# Altium schematic sheet Schematic.SchDoc
size A4
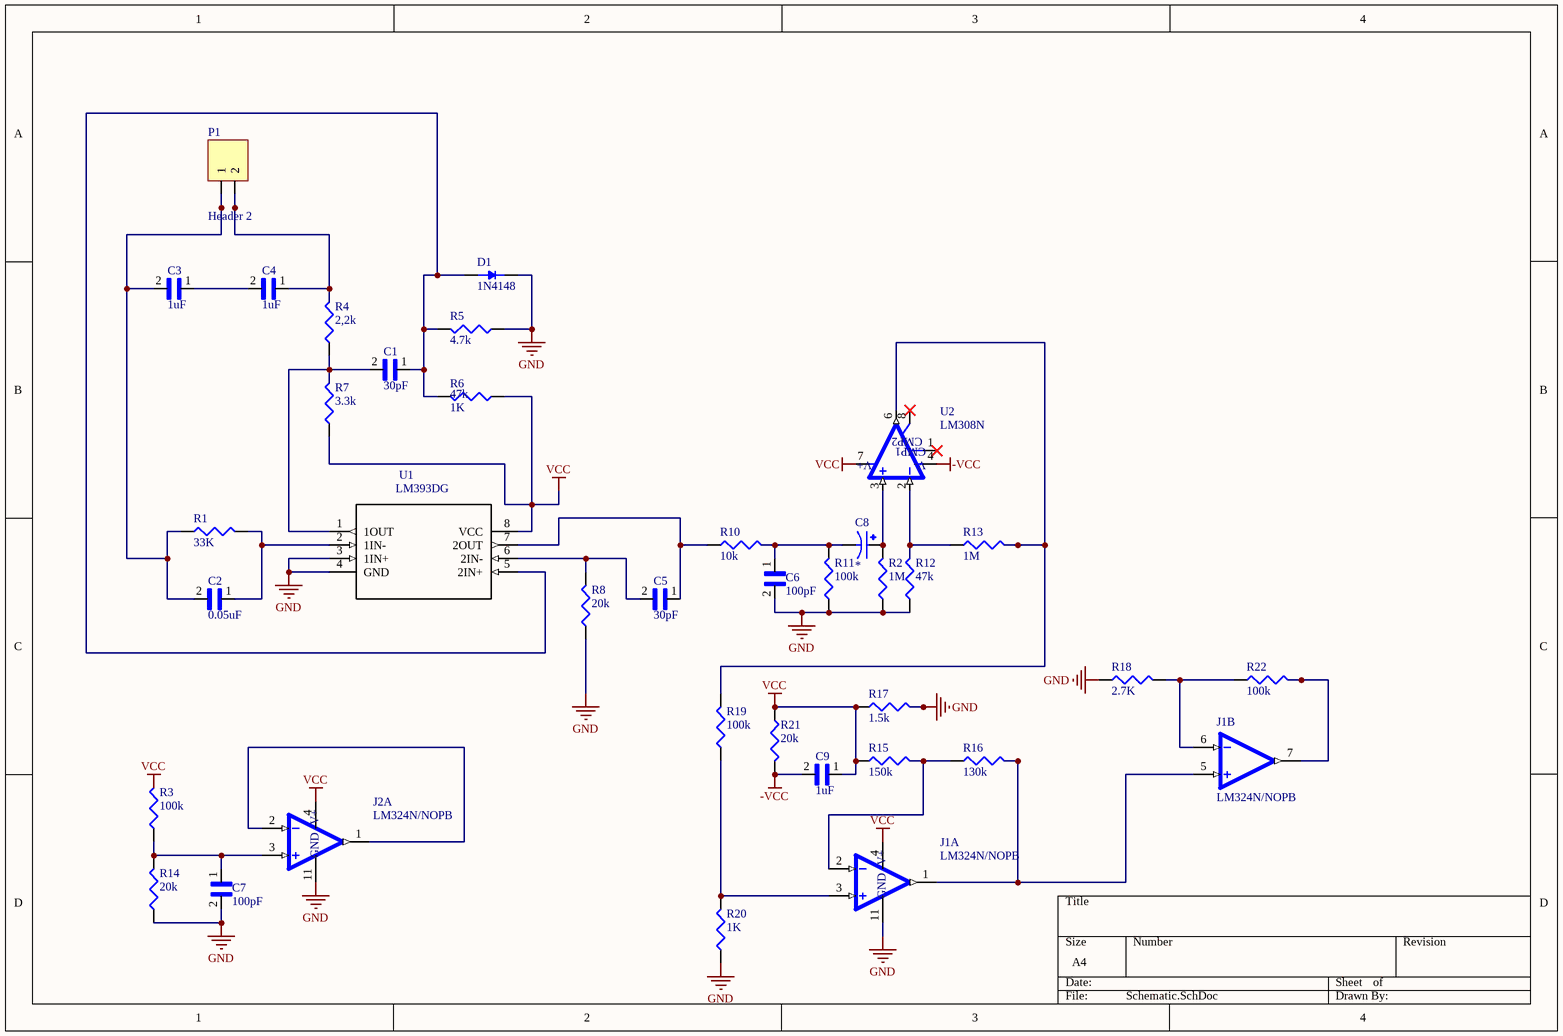
[diagram p0: Schematic.SchDoc]

## Parts
C1  30pF  [CAPC3216X190]
C2  0.05uF  [CAPC3216X190]
C3  1uF  [CAPC3216X190]
C4  1uF  [CAPC3216X190]
C5  30pF  [CAPC3216X190]
C6  100pF  [CAPC3216X190]
C7  100pF  [CAPC3216X190]
C8  *  [CAPPRD250W50D630H1120]
C9  1uF  [CAPC3216X190]
D1  1N4148  [DIODFN60X30X36-2N]
J1  LM324N/NOPB  [DIP825W47P254L1917H533Q14]  (parts A,B of 4)
J2  LM324N/NOPB  [DIP825W47P254L1917H533Q14]  (part A of 4)
P1  Header 2  [HDR1X2]
R1  value 33K  [J1-0603]
R2  value 1M  [J1-0603]
R3  value 100k  [J1-0603]
R4  value 2,2k  [J1-0603]
R5  value 4.7k  [J1-0603]
R6  47k  value 1K  [J1-0603]
R7  value 3.3k  [J1-0603]
R8  value 20k  [J1-0603]
R10  value 10k  [J1-0603]
R11  value 100k  [J1-0603]
R12  value 47k  [J1-0603]
R13  value 1M  [J1-0603]
R14  value 20k  [J1-0603]
R15  value 150k  [J1-0603]
R16  value 130k  [J1-0603]
R17  value 1.5k  [J1-0603]
R18  value 2.7K  [J1-0603]
R19  value 100k  [J1-0603]
R20  value 1K  [J1-0603]
R21  value 20k  [J1-0603]
R22  value 100k  [J1-0603]
U1  LM393DG  [SOIC127P599X175-8N]
U2  LM308N  [DIP794W45P254L1016H533Q8]

## Nets
-VCC: C9.2 R21.2 U2.4(V-)
GND: C6.2 C7.2 D1.C J1.11(GND) J2.11(GND) R2.1 R5.1 R8.1 R11.1 R12.1 R14.1 R17.2 R18.1 R20.1 U1.3(1IN+) U1.4(GND)
VCC: C9.1 J1.4(V+) J2.4(V+) R6.1 R7.1 R15.1 R17.1 R21.1 U1.8(VCC) U2.7(V+)
NetC1_1: C1.1 D1.A R5.2 R6.2 U1.5(2IN+)
NetC1_2: C1.2 R4.1 R7.2 U1.1(1OUT)
NetC2_1: C2.1 R1.2 U1.2(1IN-)
NetC2_2: C2.2 C3.2 P1.1 R1.1
NetC3_1: C3.1 C4.2
NetC4_1: C4.1 P1.2 R4.2
NetC5_1: C5.1 R10.1 U1.7(2OUT)
NetC5_2: C5.2 R8.2 U1.6(2IN-)
NetC6_1: C6.1 C8.N R10.2 R11.2
NetC7_1: C7.1 J2.3(1IN+) R3.1 R14.2
NetC8_P: C8.P R2.2 U2.3(+IN)
NetJ1_1: J1.1(1OUT) J1.5(2IN+) R16.2
NetJ1_2: J1.2(1IN-) R15.2 R16.1
NetJ1_3: J1.3(1IN+) R19.1 R20.2
NetJ1_6: J1.6(2IN-) R18.2 R22.1
NetJ1_7: J1.7(2OUT) R22.2
NetJ2_1: J2.1(1OUT) J2.2(1IN-)
NetR12_2: R12.2 R13.1 U2.2(-IN)
NetR13_2: R13.2 R19.2 U2.6(OUT)

Not connected (* = marked no-connect by the designer): R3 2; U2 1(CMP1)* 8(CMP2)*

## Notes on the sheet
- Labels drawn without touching a wire or pin: VCC

## Library data of the parts
C1-C7 C9 = GRM31CC80E157ME11K: ÐšÐµÑ€Ð°Ð¼Ð¸Ñ‡ÐµÑÐºÐ¸Ð¹ ÐºÐ¾Ð½Ð´ÐµÐ½ÑÐ°Ñ‚Ð¾Ñ€; MF: Murata; Value: *; Price: None; Availability: In Stock; Package: 1206 Murata; MP: GRM31CC80E157ME11K; SnapEDA_Link: https://www.snapeda.com/parts/GRM31CC80E157ME11K/Murata/view-part/?ref=snap; Purchase-URL: https://pricing.snapeda.com/search/part/GRM31CC80E157ME11K/?ref=eda; Check_prices: https://www.snapeda.com/parts/GRM31CC80E157ME11K/Murata/view-part/?ref=eda
C8 = ECA1JM330I: CAP ALUM 33UF 20% 63V RADIAL; MF: Panasonic; Value: *; SnapEDA_Link: https://www.snapeda.com/parts/ECA1JM330I/Panasonic/view-part/?ref=snap; Check_prices: https://www.snapeda.com/parts/ECA1JM330I/Panasonic/view-part/?ref=eda; Purchase-URL: https://pricing.snapeda.com/search/part/ECA1JM330I/?ref=eda; Availability: In Stock; MP: ECA1JM330I; Price: None; Package: RADIAL-2 Panasonic
D1 = RB520ZS-30T2R: Diode Schottky 30V 100mA Surface Mount GMD2; MF: Rohm; SnapEDA_Link: https://www.snapeda.com/parts/RB520ZS-30T2R/Rohm/view-part/119018/?ref=snap; DigiKey-Purchase-URL: https://snapeda.com/shop?store=DigiKey&id=119018; Package: 0201 Rohm; Availability: Warning; Price: None; Mouser-Purchase-URL: https://snapeda.com/shop?store=Mouser&id=119018; MP: RB520ZS-30T2R; Value: *
J1 J2 = LM324N/NOPB: Quad, 30-V, 1.2-MHz operational amplifier; MP: LM324N; MF: Texas Instruments; Check_prices: https://www.snapeda.com/parts/LM324N/Texas+Instruments/view-part/?ref=eda; Value: *; Availability: In Stock; Price: None; Package: PDIP-14 Texas Instruments; SnapEDA_Link: https://www.snapeda.com/parts/LM324N/Texas+Instruments/view-part/?ref=snap; Purchase-URL: https://pricing.snapeda.com/search/part/LM324N/?ref=eda
P1 = Header 2: Header, 2-Pin; LatestRevisionDate: 17-Jul-2002; LatestRevisionNote: Re-released for DXP Platform.; Publisher: Altium Limited
R1-R8 R10-R22 = Res3: Resistor; Published: 8-Jun-2000; LatestRevisionDate: 29-May-2009; LatestRevisionNote: IPC-7351 Footprint Added.; PackageReference: J1-0603; Publisher: Altium Limited; PackageDescription: Chip Resistor
U1 = LM393DG: Comparator General Purpose CMOS, DTL, ECL, MOS, Open-Collector, TTL 8-SOIC; MF: ON Semiconductor; Check_prices: https://www.snapeda.com/parts/LM393DG/Onsemi/view-part/?ref=eda; Availability: In Stock; Price: None; Package: SOIC-8 ON Semiconductor; SnapEDA_Link: https://www.snapeda.com/parts/LM393DG/Onsemi/view-part/?ref=snap; Purchase-URL: https://pricing.snapeda.com/search/part/LM393DG/?ref=eda; MP: LM393DG; Value: *
U2 = LM308N: Value: *; MP: LM308N; Availability: Unavailable; Price: None; Package: None